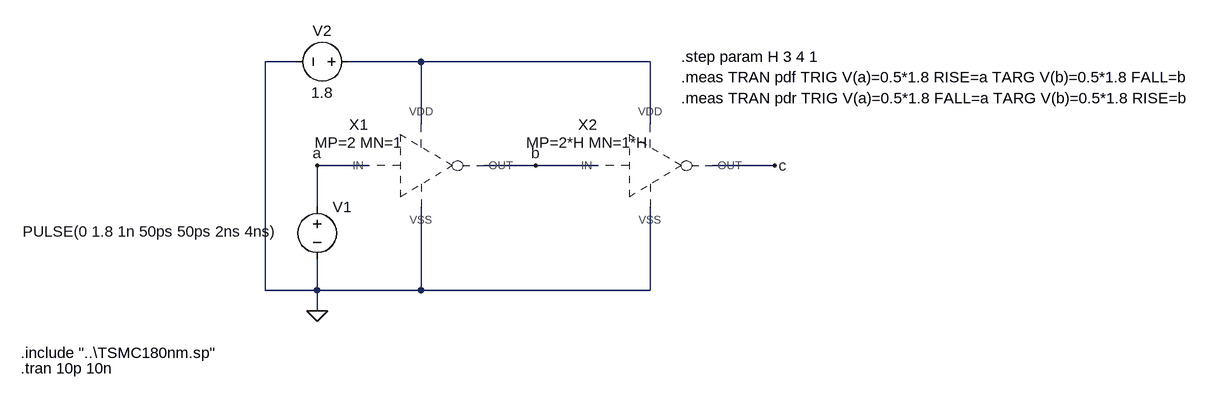
[diagram p0: schematic Problem_4-Propogation_Delays.asc]
Problem_4-Propogation_Delays.asc, the LTspice schematic file:
Version 4
SHEET 1 2620 680
WIRE -128 16 -176 16
WIRE 64 16 -48 16
WIRE 416 16 64 16
WIRE 64 112 64 16
WIRE 416 112 416 16
WIRE -16 176 -96 176
WIRE 240 176 160 176
WIRE 336 176 240 176
WIRE 608 176 512 176
WIRE -96 240 -96 176
WIRE -176 368 -176 16
WIRE -96 368 -96 320
WIRE -96 368 -176 368
WIRE 64 368 64 240
WIRE 64 368 -96 368
WIRE 416 368 416 240
WIRE 416 368 64 368
WIRE -96 400 -96 368
FLAG -96 176 a
FLAG -96 400 0
FLAG 240 176 b
FLAG 608 176 c
SYMBOL INV -16 176 R0
WINDOW 39 -16 -20 Bottom 2
SYMATTR SpiceLine MP=2 MN=1
SYMATTR InstName X1
SYMBOL voltage -32 16 R90
WINDOW 0 -32 56 VBottom 2
WINDOW 3 32 56 VTop 2
WINDOW 123 0 0 Left 0
WINDOW 39 0 0 Left 0
SYMATTR InstName V2
SYMATTR Value 1.8
SYMBOL voltage -96 224 R0
WINDOW 3 -453 53 Left 2
WINDOW 123 0 0 Left 0
WINDOW 39 0 0 Left 0
SYMATTR Value PULSE(0 1.8 1n 50ps 50ps 2ns 4ns)
SYMATTR InstName V1
SYMBOL INV 336 176 R0
WINDOW 39 -16 -20 Bottom 2
SYMATTR SpiceLine MP=2*H MN=1*H
SYMATTR InstName X2
TEXT -552 464 Left 2 !.include "..\\TSMC180nm.sp"
TEXT -552 488 Left 2 !.tran 10p 10n
TEXT 464 72 Left 2 !.meas TRAN pdr TRIG V(a)=0.5*1.8 FALL=a TARG V(b)=0.5*1.8 RISE=b
TEXT 464 40 Left 2 !.meas TRAN pdf TRIG V(a)=0.5*1.8 RISE=a TARG V(b)=0.5*1.8 FALL=b
TEXT 464 8 Left 2 !.step param H 3 4 1

The netlist it stands for:
* Problem_4-Propogation_Delays.asc
XX1 a b N001 0 INV params: MP=2 MN=1  ; pins IN OUT VDD VSS
V2 N001 0 1.8
V1 a 0 PULSE(0 1.8 1n 50ps 50ps 2ns 4ns)
XX2 b c N001 0 INV params: MP=2*H MN=1*H  ; pins IN OUT VDD VSS
.include "..\TSMC180nm.sp"
.tran 10p 10n
.meas TRAN pdr TRIG V(a)=0.5*1.8 FALL=a TARG V(b)=0.5*1.8 RISE=b
.meas TRAN pdf TRIG V(a)=0.5*1.8 RISE=a TARG V(b)=0.5*1.8 FALL=b
.step param H 3 4 1
.backanno
.end